# EAGLE design 7_cpu_powercon (EAGLE 6.6.0)
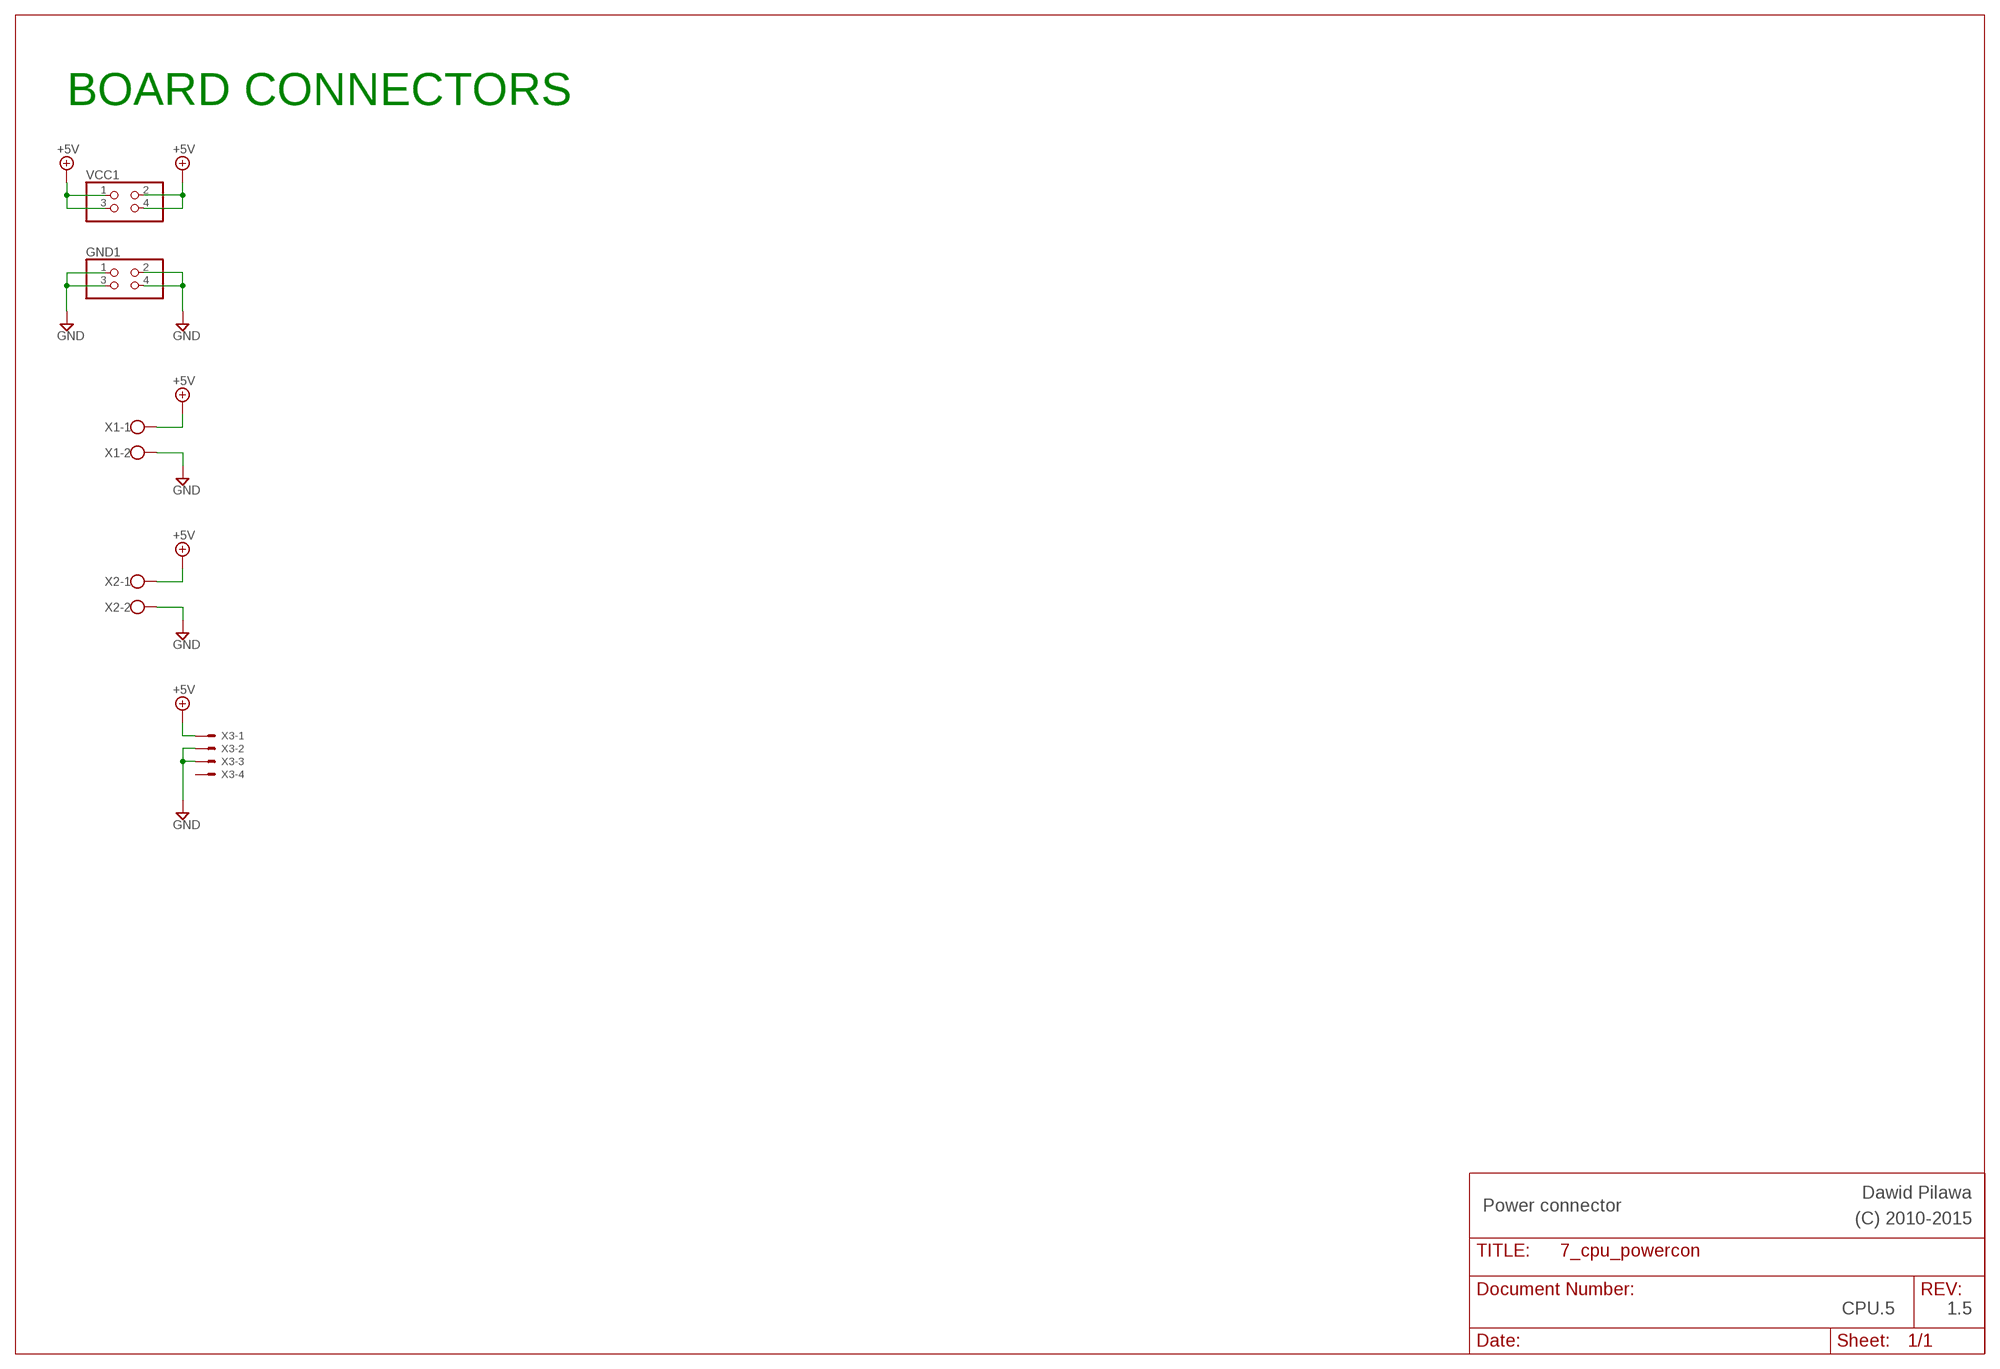
[diagram p0: schematic, sheet 1]

## Parts
GND1  PINHD-2X2  [2X02]
VCC1  PINHD-2X2  [2X02]
X1  W237-102  [W237-102]
X2  W237-102  [W237-102]
X3  KK-156-4  [KK-156-4]

## Nets
+5V: VCC1.1 VCC1.2 VCC1.3 VCC1.4 X1.1 X2.1 X3.1
GND: GND1.1 GND1.2 GND1.3 GND1.4 X1.2 X2.2 X3.2 X3.3
Unconnected: X3.4

## Notes on the sheet
- BOARD CONNECTORS
- Dawid Pilawa
- Power connector | (C) 2010-2015
- CPU.5 | 1.5

## Library data of the parts
GND1 VCC1 = pinhead:PINHD-2X2: PIN HEADER
X1 X2 = con-wago-500:W237-102: WAGO SCREW CLAMP; MPN: 237-102; OC_FARNELL: unknown; OC_NEWARK: 70K9898
X3 = con-molex:KK-156-4: KK 156 HEADER Source: http://www.molex.com/pdm_docs/sd/026604100_sd.pdf; OC_FARNELL: unknown; OC_NEWARK: unknown

## Board
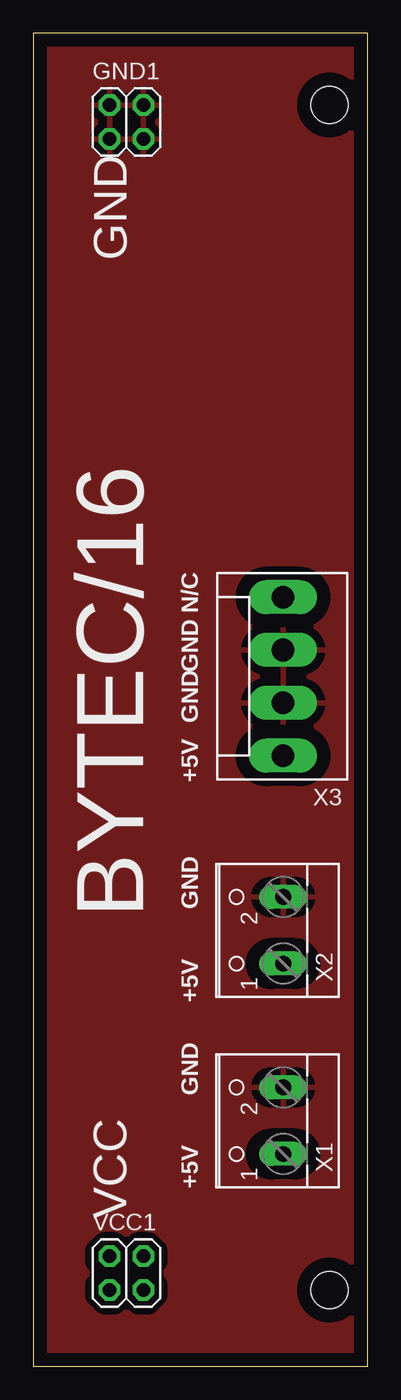
[diagram p1: board, top side]
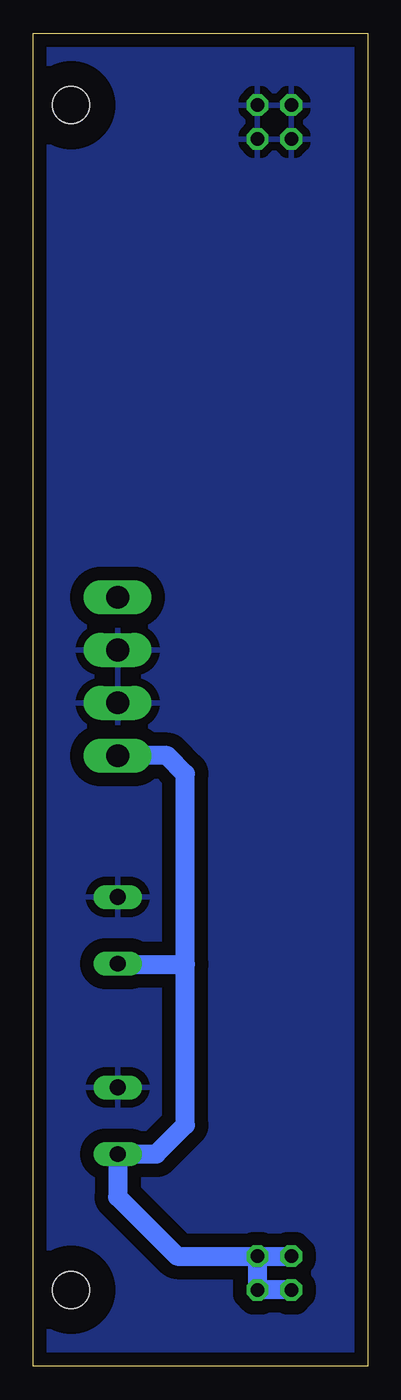
[diagram p2: board, bottom side, seen from below]

Size 25.06 x 100 mm. Coordinates in mm from the lower left corner, seen from the top.
Outline: 0,0 25.06,0 25.06,100 0,100 0,0
Copper layers (1*16): Top 0.035mm / dielectric 1.5mm / Bottom 0.035mm
Design rules "homebrew_pcb": minimum track width 16mil, minimum drill 24mil, track to track 16mil, track to pad 10mil, pad to pad 10mil, via to via 10mil, smd to smd 8mil, copper to edge 30mil, drill to drill 10mil, minimum pad ring 12mil, minimum via ring 12mil, stop-mask expansion 4mil, vias tented up to drill 0mil, thermal gap 24mil
Holes 2.79 mm at 22.22,5.71 22.22,94.61
bRestrict: area 19.9,92.3 to 24.5,96.9; area 19.9,3.4 to 24.5,8
vRestrict: area 19.9,92.3 to 24.5,96.9; area 19.9,3.4 to 24.5,8

### Footprints (pad centres in the part's own frame; a part is rotated, then mirrored left to right if it is on the bottom)
2X02 = drill 1.016 octagon: 1 -1.27,-1.27; 2 -1.27,1.27; 3 1.27,-1.27; 4 1.27,1.27
W237-102 = drill 1.194 long: 1 -2.5,-1.27; 2 2.5,-1.27
KK-156-4 = drill 1.7 pad 2.184 long: 1 -5.94,0; 2 -1.98,0; 3 1.98,0; 4 5.94,0

### Placement (x,y rotation side)
GND1  6.99,93.34 0 top
VCC1  6.99,6.99 0 top
X1  17.46,18.41 90 top
X2  17.46,32.7 90 top
X3  18.73,51.75 90 top

### Tracks (layer width: path | path; a pad name or v marks a point on that pad's centre or on a via)
+5V
  Bottom 1.422: VCC1.4 14.29,8.26 18.73,12.7 X1.1 15.84,15.91 13.65,18.1 13.65,30.16 | VCC1.4 VCC1.2 | VCC1.1 VCC1.3 VCC1.4 | 13.65,30.16 13.65,44.45 15.01,45.81 X3.1 | X2.1 18.69,30.16 13.65,30.16
GND
  pour Bottom (isolate 1.016): 0,100.01 25.08,100.01 25.08,0 0,0
  pour Top (isolate 1.016): 0,100.01 25.08,100.01 25.08,0 0,0

### Text on the board
tsilk: GND | BYTEC/16 | VCC
_tplace: N/C | GND | GND | +5V | GND | +5V | GND | +5V